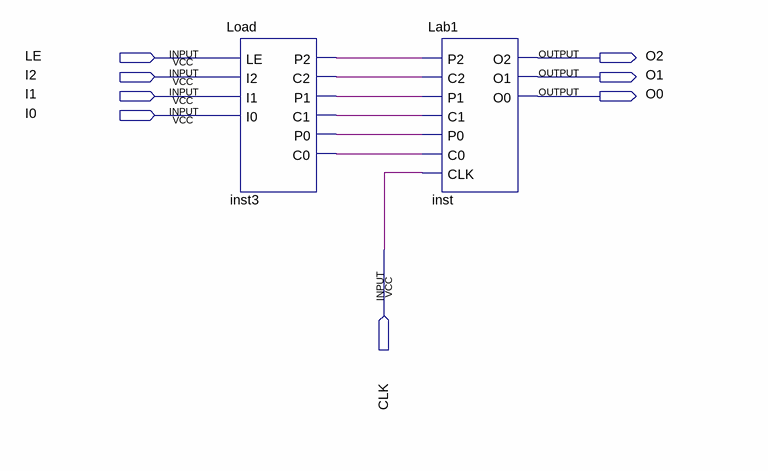
[diagram p0: schematic sheet]
// Quartus schematic Final_Synchronous_Counter_Parallel_WithBCD.bdf as structural Verilog: 2 symbols, 8 pins
module Final_Synchronous_Counter_Parallel_WithBCD (
  input  LE,
  input  I2,
  input  I1,
  input  I0,
  input  CLK,
  output O2,
  output O1,
  output O0
);

  wire inst3_c0, inst3_c1, inst3_c2, inst3_p0, inst3_p1, inst3_p2;

  Load inst3 (
    .LE(LE), .I2(I2), .I1(I1), .I0(I0), .P2(inst3_p2), .C2(inst3_c2), .P1(inst3_p1), .C1(inst3_c1),
    .P0(inst3_p0), .C0(inst3_c0));
  Lab1 inst (
    .P2(inst3_p2), .C2(inst3_c2), .P1(inst3_p1), .C1(inst3_c1), .P0(inst3_p0), .C0(inst3_c0), .CLK(CLK),
    .O2(O2), .O1(O1), .O0(O0));
endmodule
